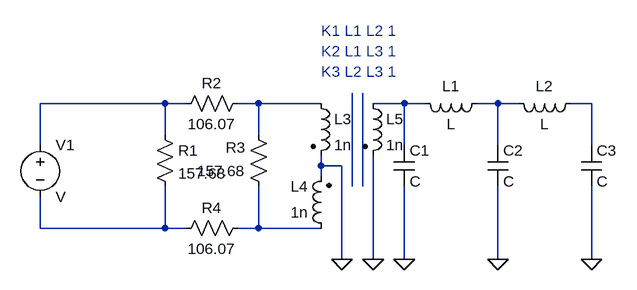
[diagram p0: schematic Draft3.asc]
Draft3.asc, the LTspice schematic file:
Version 4
SHEET 1 880 680
WIRE -32 112 -224 112
WIRE 0 112 -32 112
WIRE 112 112 80 112
WIRE 208 112 112 112
WIRE 336 112 288 112
WIRE 368 112 336 112
WIRE 480 112 448 112
WIRE 512 112 480 112
WIRE 624 112 592 112
WIRE -32 160 -32 112
WIRE 112 160 112 112
WIRE -224 176 -224 112
WIRE 336 176 336 112
WIRE 480 176 480 112
WIRE 624 176 624 112
WIRE 208 208 208 192
WIRE 240 208 208 208
WIRE 208 224 208 208
WIRE 256 240 256 96
WIRE 272 240 272 96
WIRE -224 304 -224 256
WIRE -32 304 -32 240
WIRE -32 304 -224 304
WIRE 0 304 -32 304
WIRE 112 304 112 240
WIRE 112 304 80 304
WIRE 208 304 112 304
WIRE 240 352 240 208
WIRE 288 352 288 192
WIRE 336 352 336 240
WIRE 480 352 480 240
WIRE 624 352 624 240
FLAG 240 352 0
FLAG 480 352 0
FLAG 624 352 0
FLAG 336 352 0
FLAG 288 352 0
SYMBOL res -48 144 R0
SYMATTR InstName R1
SYMATTR Value 157.68
SYMBOL res 96 96 R90
WINDOW 0 0 56 VBottom 2
WINDOW 3 32 56 VTop 2
SYMATTR InstName R2
SYMATTR Value 106.07
SYMBOL res 128 256 R180
WINDOW 0 36 76 Left 2
WINDOW 3 36 40 Left 2
SYMATTR InstName R3
SYMATTR Value 157.68
SYMBOL cap 320 176 R0
SYMATTR InstName C1
SYMBOL cap 464 176 R0
SYMATTR InstName C2
SYMBOL cap 608 176 R0
SYMATTR InstName C3
SYMBOL ind 464 96 R90
WINDOW 0 5 56 VBottom 2
WINDOW 3 32 56 VTop 2
SYMATTR InstName L1
SYMBOL ind 608 96 R90
WINDOW 0 5 56 VBottom 2
WINDOW 3 32 56 VTop 2
SYMATTR InstName L2
SYMBOL ind2 192 96 R0
SYMATTR InstName L3
SYMATTR Value 1n
SYMBOL ind2 224 320 R180
WINDOW 0 36 80 Left 2
WINDOW 3 36 40 Left 2
SYMATTR InstName L4
SYMATTR Value 1n
SYMBOL ind2 272 96 R0
SYMATTR InstName L5
SYMATTR Value 1n
SYMBOL res 96 288 R90
WINDOW 0 0 56 VBottom 2
WINDOW 3 32 56 VTop 2
SYMATTR InstName R4
SYMATTR Value 106.07
SYMBOL voltage -224 160 R0
SYMATTR InstName V1
TEXT 208 0 Left 2 ;K1 L1 L2 1\nK2 L1 L3 1\nK3 L2 L3 1

The netlist it stands for:
* Draft3.asc
R1 N001 N008 157.68
R2 N002 N001 106.07
R3 N009 N002 157.68
C1 N003 0 C
C2 N004 0 C
C3 N005 0 C
L1 N004 N003 L
L2 N005 N004 L
L3 N002 0 1n
L4 N009 0 1n
L5 N003 0 1n
R4 N009 N008 106.07
V1 N001 N008 V
* K1 L1 L2 1
* K2 L1 L3 1
* K3 L2 L3 1
.backanno
.end